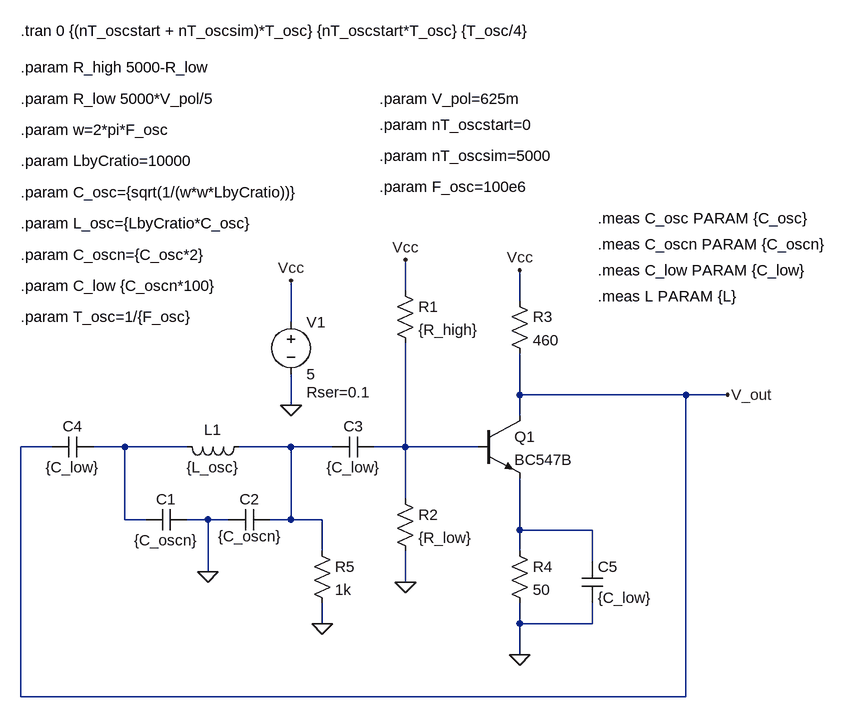
[diagram p0: schematic ParametizedColpitts.asc]
ParametizedColpitts.asc, the LTspice schematic file:
Version 4
SHEET 1 1688 680
WIRE 512 -160 512 -208
WIRE 688 -144 688 -192
WIRE 336 -112 336 -176
WIRE 688 0 688 -64
WIRE 944 0 688 0
WIRE 1008 0 944 0
WIRE 336 16 336 -32
WIRE 688 32 688 0
WIRE -32 80 -80 80
WIRE 80 80 32 80
WIRE 176 80 80 80
WIRE 336 80 256 80
WIRE 400 80 336 80
WIRE 512 80 512 -80
WIRE 512 80 464 80
WIRE 624 80 512 80
WIRE 512 160 512 80
WIRE 80 192 80 80
WIRE 112 192 80 192
WIRE 208 192 176 192
WIRE 240 192 208 192
WIRE 336 192 336 80
WIRE 336 192 304 192
WIRE 384 192 336 192
WIRE 688 208 688 128
WIRE 800 208 688 208
WIRE 384 240 384 192
WIRE 688 240 688 208
WIRE 800 256 800 208
WIRE 208 272 208 192
WIRE 512 288 512 240
WIRE 384 352 384 320
WIRE 688 352 688 320
WIRE 800 352 800 320
WIRE 800 352 688 352
WIRE 688 400 688 352
WIRE -80 464 -80 80
WIRE 944 464 944 0
WIRE 944 464 -80 464
FLAG 512 288 0
FLAG 688 400 0
FLAG 688 -192 Vcc
FLAG 512 -208 Vcc
FLAG 336 -176 Vcc
FLAG 336 16 0
FLAG 208 272 0
FLAG 1008 0 V_out
FLAG 384 352 0
SYMBOL cap 176 176 R90
WINDOW 0 0 32 VBottom 2
WINDOW 3 32 32 VTop 2
SYMATTR InstName C1
SYMATTR Value {C_oscn}
SYMBOL cap 304 176 R90
WINDOW 0 0 32 VBottom 2
WINDOW 3 57 31 VBottom 2
SYMATTR InstName C2
SYMATTR Value {C_oscn}
SYMBOL ind 272 64 R90
WINDOW 0 5 56 VBottom 2
WINDOW 3 32 56 VTop 2
SYMATTR InstName L1
SYMATTR Value {L_osc}
SYMBOL cap 464 64 R90
WINDOW 0 0 32 VBottom 2
WINDOW 3 32 32 VTop 2
SYMATTR InstName C3
SYMATTR Value {C_low}
SYMBOL cap 32 64 R90
WINDOW 0 0 32 VBottom 2
WINDOW 3 32 32 VTop 2
SYMATTR InstName C4
SYMATTR Value {C_low}
SYMBOL npn 624 32 R0
SYMATTR InstName Q1
SYMATTR Value BC547B
SYMBOL res 496 -176 R0
SYMATTR InstName R1
SYMATTR Value {R_high}
SYMBOL res 496 144 R0
SYMATTR InstName R2
SYMATTR Value {R_low}
SYMBOL res 672 -160 R0
SYMATTR InstName R3
SYMATTR Value 460
SYMBOL res 672 224 R0
SYMATTR InstName R4
SYMATTR Value 50
SYMBOL cap 784 256 R0
SYMATTR InstName C5
SYMATTR Value {C_low}
SYMBOL voltage 336 -128 R0
WINDOW 123 0 0 Left 0
WINDOW 39 24 124 Left 2
SYMATTR SpiceLine Rser=0.1
SYMATTR InstName V1
SYMATTR Value 5
SYMBOL res 368 224 R0
SYMATTR InstName R5
SYMATTR Value 1k
TEXT -80 -560 Left 2 !.tran 0 {(nT_oscstart + nT_oscsim)*T_osc} {nT_oscstart*T_osc} {T_osc/4}
TEXT -80 -312 Left 2 !.param C_osc={sqrt(1/(w*w*LbyCratio))}
TEXT -80 -168 Left 2 !.param C_low {C_oscn*100}
TEXT 472 -320 Left 2 !.param F_osc=100e6
TEXT -80 -216 Left 2 !.param C_oscn={C_osc*2}
TEXT -80 -504 Left 2 !.param R_high 5000-R_low
TEXT 472 -456 Left 2 !.param V_pol=625m
TEXT -80 -456 Left 2 !.param R_low 5000*V_pol/5
TEXT -80 -264 Left 2 !.param L_osc={LbyCratio*C_osc}
TEXT -80 -408 Left 2 !.param w=2*pi*F_osc
TEXT -80 -120 Left 2 !.param T_osc=1/{F_osc}
TEXT -80 -360 Left 2 !.param LbyCratio=10000
TEXT 808 -272 Left 2 !.meas C_osc PARAM {C_osc}
TEXT 808 -232 Left 2 !.meas C_oscn PARAM {C_oscn}
TEXT 808 -152 Left 2 !.meas L PARAM {L}
TEXT 808 -192 Left 2 !.meas C_low PARAM {C_low}
TEXT 472 -368 Left 2 !.param nT_oscsim=5000
TEXT 472 -416 Left 2 !.param nT_oscstart=0

The netlist it stands for:
* ParametizedColpitts.asc
C1 0 N001 {C_oscn}
C2 N002 0 {C_oscn}
L1 N002 N001 {L_osc}
C3 N003 N002 {C_low}
C4 N001 V_out {C_low}
Q1 V_out N003 N004 0 BC547B
R1 Vcc N003 {R_high}
R2 N003 0 {R_low}
R3 Vcc V_out 460
R4 N004 0 50
C5 N004 0 {C_low}
V1 Vcc 0 5 Rser=0.1
R5 N002 0 1k
.model NPN NPN
.model PNP PNP
.lib standard.bjt
.tran 0 {(nT_oscstart + nT_oscsim)*T_osc} {nT_oscstart*T_osc} {T_osc/4}
.param C_osc={sqrt(1/(w*w*LbyCratio))}
.param C_low {C_oscn*100}
.param F_osc=100e6
.param C_oscn={C_osc*2}
.param R_high 5000-R_low
.param V_pol=625m
.param R_low 5000*V_pol/5
.param L_osc={LbyCratio*C_osc}
.param w=2*pi*F_osc
.param T_osc=1/{F_osc}
.param LbyCratio=10000
.meas C_osc PARAM {C_osc}
.meas C_oscn PARAM {C_oscn}
.meas L PARAM {L}
.meas C_low PARAM {C_low}
.param nT_oscsim=5000
.param nT_oscstart=0
.backanno
.end